# Altium schematic sheet Sheet1.SchDoc
size A; SheetNumber: 1; SheetTotal: 3
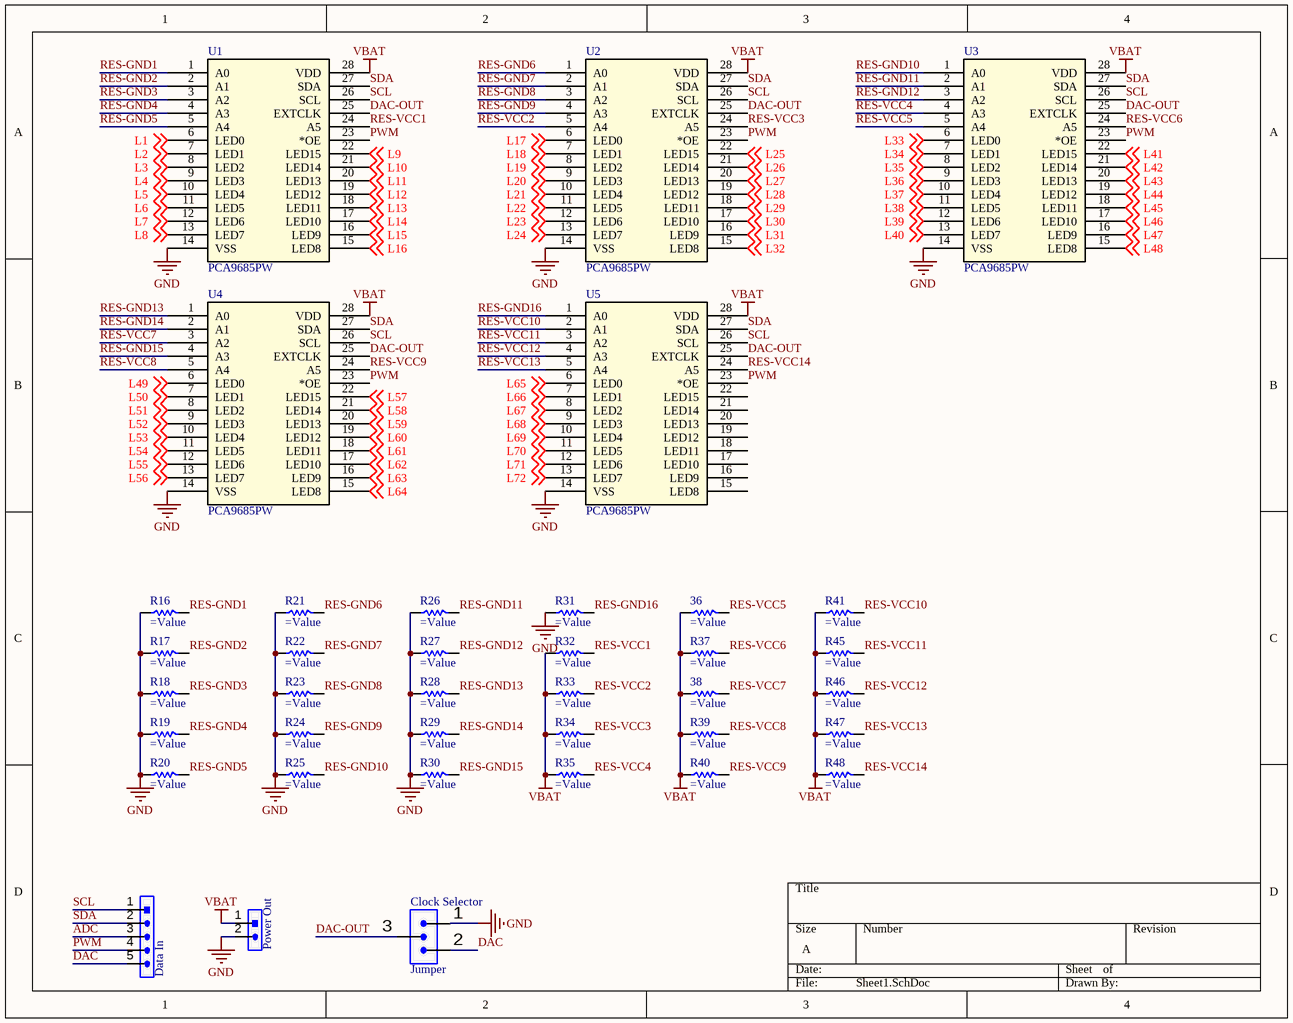
[diagram p0: Sheet1.SchDoc]

## Parts
36  (no value)  [R 0805]
38  (no value)  [R 0805]
Clock_Selector  Jumper  [Jumper Selector]
Data_In  HDR-1X5  [XH2.54-5P_H]  (value not drawn)
Power_Out  HDR-1X2  [XH2.54-2P_H]  (value not drawn)
R16  (no value)  [R 0805]
R17  (no value)  [R 0805]
R18  (no value)  [R 0805]
R19  (no value)  [R 0805]
R20  (no value)  [R 0805]
R21  (no value)  [R 0805]
R22  (no value)  [R 0805]
R23  (no value)  [R 0805]
R24  (no value)  [R 0805]
R25  (no value)  [R 0805]
R26  (no value)  [R 0805]
R27  (no value)  [R 0805]
R28  (no value)  [R 0805]
R29  (no value)  [R 0805]
R30  (no value)  [R 0805]
R31  (no value)  [R 0805]
R32  (no value)  [R 0805]
R33  (no value)  [R 0805]
R34  (no value)  [R 0805]
R35  (no value)  [R 0805]
R37  (no value)  [R 0805]
R39  (no value)  [R 0805]
R40  (no value)  [R 0805]
R41  (no value)  [R 0805]
R45  (no value)  [R 0805]
R46  (no value)  [R 0805]
R47  (no value)  [R 0805]
R48  (no value)  [R 0805]
U1  PCA9685PW  [SOT361-1_NXP]
U2  PCA9685PW  [SOT361-1_NXP]
U3  PCA9685PW  [SOT361-1_NXP]
U4  PCA9685PW  [SOT361-1_NXP]
U5  PCA9685PW  [SOT361-1_NXP]

## Nets
GND: Clock_Selector.1(IN) Power_Out.2 R16.1 R17.1 R18.1 R19.1 R20.1 R21.1 R22.1 R23.1 R24.1 R25.1 R26.1 R27.1 R28.1 R29.1 R30.1 R31.1 U1.14(VSS) U2.14(VSS) U3.14(VSS) U4.14(VSS) U5.14(VSS)
VBAT: 36.1 38.1 Power_Out.1 R32.1 R33.1 R34.1 R35.1 R37.1 R39.1 R40.1 R41.1 R45.1 R46.1 R47.1 R48.1 U1.28(VDD) U2.28(VDD) U3.28(VDD) U4.28(VDD) U5.28(VDD)
ADC: Data_In.3
DAC: Data_In.5
DAC-OUT: Clock_Selector.3(IN) U1.25(EXTCLK) U2.25(EXTCLK) U3.25(EXTCLK) U4.25(EXTCLK) U5.25(EXTCLK)
L1: U1.6(LED0) ; off-sheet L1
L2: U1.7(LED1) ; off-sheet L2
L3: U1.8(LED2) ; off-sheet L3
L4: U1.9(LED3) ; off-sheet L4
L5: U1.10(LED4) ; off-sheet L5
L6: U1.11(LED5) ; off-sheet L6
L7: U1.12(LED6) ; off-sheet L7
L8: U1.13(LED7) ; off-sheet L8
L9: U1.22(LED15) ; off-sheet L9
L10: U1.21(LED14) ; off-sheet L10
L11: U1.20(LED13) ; off-sheet L11
L12: U1.19(LED12) ; off-sheet L12
L13: U1.18(LED11) ; off-sheet L13
L14: U1.17(LED10) ; off-sheet L14
L15: U1.16(LED9) ; off-sheet L15
L16: U1.15(LED8) ; off-sheet L16
L17: U2.6(LED0) ; off-sheet L17
L18: U2.7(LED1) ; off-sheet L18
L19: U2.8(LED2) ; off-sheet L19
L20: U2.9(LED3) ; off-sheet L20
L21: U2.10(LED4) ; off-sheet L21
L22: U2.11(LED5) ; off-sheet L22
L23: U2.12(LED6) ; off-sheet L23
L24: U2.13(LED7) ; off-sheet L24
L25: U2.22(LED15) ; off-sheet L25
L26: U2.21(LED14) ; off-sheet L26
L27: U2.20(LED13) ; off-sheet L27
L28: U2.19(LED12) ; off-sheet L28
L29: U2.18(LED11) ; off-sheet L29
L30: U2.17(LED10) ; off-sheet L30
L31: U2.16(LED9) ; off-sheet L31
L32: U2.15(LED8) ; off-sheet L32
L33: U3.6(LED0) ; off-sheet L33
L34: U3.7(LED1) ; off-sheet L34
L35: U3.8(LED2) ; off-sheet L35
L36: U3.9(LED3) ; off-sheet L36
L37: U3.10(LED4) ; off-sheet L37
L38: U3.11(LED5) ; off-sheet L38
L39: U3.12(LED6) ; off-sheet L39
L40: U3.13(LED7) ; off-sheet L40
L41: U3.22(LED15) ; off-sheet L41
L42: U3.21(LED14) ; off-sheet L42
L43: U3.20(LED13) ; off-sheet L43
L44: U3.19(LED12) ; off-sheet L44
L45: U3.18(LED11) ; off-sheet L45
L46: U3.17(LED10) ; off-sheet L46
L47: U3.16(LED9) ; off-sheet L47
L48: U3.15(LED8) ; off-sheet L48
L49: U4.6(LED0) ; off-sheet L49
L50: U4.7(LED1) ; off-sheet L50
L51: U4.8(LED2) ; off-sheet L51
L52: U4.9(LED3) ; off-sheet L52
L53: U4.10(LED4) ; off-sheet L53
L54: U4.11(LED5) ; off-sheet L54
L55: U4.12(LED6) ; off-sheet L55
L56: U4.13(LED7) ; off-sheet L56
L57: U4.22(LED15) ; off-sheet L57
L58: U4.21(LED14) ; off-sheet L58
L59: U4.20(LED13) ; off-sheet L59
L60: U4.19(LED12) ; off-sheet L60
L61: U4.18(LED11) ; off-sheet L61
L62: U4.17(LED10) ; off-sheet L62
L63: U4.16(LED9) ; off-sheet L63
L64: U4.15(LED8) ; off-sheet L64
L65: U5.6(LED0) ; off-sheet L65
L66: U5.7(LED1) ; off-sheet L66
L67: U5.8(LED2) ; off-sheet L67
L68: U5.9(LED3) ; off-sheet L68
L69: U5.10(LED4) ; off-sheet L69
L70: U5.11(LED5) ; off-sheet L70
L71: U5.12(LED6) ; off-sheet L71
L72: U5.13(LED7) ; off-sheet L72
PWM: Data_In.4 U1.23(*OE) U2.23(*OE) U3.23(*OE) U4.23(*OE) U5.23(*OE)
RES-GND1: R16.2 U1.1(A0)
RES-GND2: R17.2 U1.2(A1)
RES-GND3: R18.2 U1.3(A2)
RES-GND4: R19.2 U1.4(A3)
RES-GND5: R20.2 U1.5(A4)
RES-GND6: R21.2 U2.1(A0)
RES-GND7: R22.2 U2.2(A1)
RES-GND8: R23.2 U2.3(A2)
RES-GND9: R24.2 U2.4(A3)
RES-GND10: R25.2 U3.1(A0)
RES-GND11: R26.2 U3.2(A1)
RES-GND12: R27.2 U3.3(A2)
RES-GND13: R28.2 U4.1(A0)
RES-GND14: R29.2 U4.2(A1)
RES-GND15: R30.2 U4.4(A3)
RES-GND16: R31.2 U5.1(A0)
RES-VCC1: R32.2 U1.24(A5)
RES-VCC2: R33.2 U2.5(A4)
RES-VCC3: R34.2 U2.24(A5)
RES-VCC4: R35.2 U3.4(A3)
RES-VCC5: 36.2 U3.5(A4)
RES-VCC6: R37.2 U3.24(A5)
RES-VCC7: 38.2 U4.3(A2)
RES-VCC8: R39.2 U4.5(A4)
RES-VCC9: R40.2 U4.24(A5)
RES-VCC10: R41.2 U5.2(A1)
RES-VCC11: R45.2 U5.3(A2)
RES-VCC12: R46.2 U5.4(A3)
RES-VCC13: R47.2 U5.5(A4)
RES-VCC14: R48.2 U5.24(A5)
SCL: Data_In.1 U1.26(SCL) U2.26(SCL) U3.26(SCL) U4.26(SCL) U5.26(SCL)
SDA: Data_In.2 U1.27(SDA) U2.27(SDA) U3.27(SDA) U4.27(SDA) U5.27(SDA)

Not connected (* = marked no-connect by the designer): Clock_Selector 2(IN); U5 15(LED8) 16(LED9) 17(LED10) 18(LED11) 19(LED12) 20(LED13) 21(LED14) 22(LED15)

## Library data of the parts
36 38 R16-R35 R37 R39-R41 R45-R48 = R: Chip resistor; 版权归属: 源创客; BOM名称: Chip resistor; 学习资源: www.ooocke.com
Clock_Selector = Jumper Selector
Data_In = Header 5: 5P Connector; BOM名称: 5P接插件; 版权归属: 源创客; 学习资源: www.ooocke.com
Power_Out = Header 2: 2P Connector; BOM名称: 2P接插件; 版权归属: 源创客; 学习资源: www.ooocke.com
U1-U5 = PCA9685PW: No Description Available; Vendor: NXP; Built_By: EMA_UL_Team; SourceLibrary: NXP_2011-11-10; Manufacturer_Part_Number: PCA9685PW; Copyright: Copyright (C) 2018 Accelerated Designs. All rights reserved; RefDes: RefDes; Type: DEV